# Altium schematic sheet Barometer.SchDoc
size A; SheetNumber: 4; SheetTotal: 4
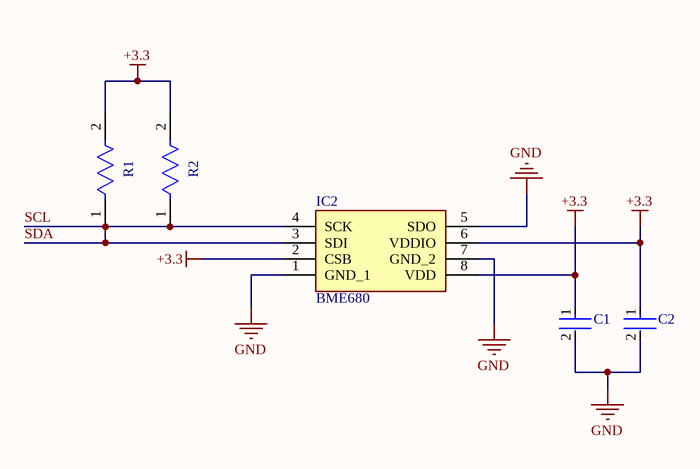
[diagram p0: Barometer.SchDoc]

## Parts
C1  CC0402KRX7R7BB104  [FP-CC0402-MFG]  (value not drawn)
C2  CC0402KRX7R7BB104  [FP-CC0402-MFG]  (value not drawn)
IC2  BME680  [BME680]
R1  AC1206JR-074K7L  [FP-AC1206-MFG]  (value not drawn)
R2  AC1206JR-074K7L  [FP-AC1206-MFG]  (value not drawn)

## Nets
+3.3: C1.1 C2.1 IC2.2(CSB) IC2.6(VDDIO) IC2.8(VDD) R1.2 R2.2
GND: C1.2 C2.2 IC2.1(GND_1) IC2.5(SDO) IC2.7(GND_2)
SCL: IC2.3(SDI) IC2.4(SCK) R1.1 R2.1  [also labelled SDA]

## Library data of the parts
C1 C2 = CMP-03422-000048-1: CAP CER 0.1UF 16V X7R 0402; Manufacturer: YAGEO; Material: Ceramic; Automotive Grade: NA; Capacitance: 100 nF; Temperature Coefficient: 30ppm/°C; Tolerance: 0.1; Value: 100 nF; Device Class L1: Passive Components; Temperature Range Low: -55°C; Device Class L3: Ceramic Capacitors; Temperature Characteristic: X7R; Ipc Land Pattern Name: CAPC10050X50; Temperature Range High: +125°C; Voltage Rating: 16 V; Temperature: -55°C to +125°C; RoHS: TRUE; Automotive: No; Height: 0.55mm; Device Class L2: Capacitors; Digikey Description: CAP CER 0.1UF 16V X7R 0402; Package: CC0402; Footprint Url: http://www.yageo.com/exep/pages/download/literatures/UPY-C_GEN_24.pdf; ComponentLink2Description: Datasheet; Category: Cap; Lead Free: Yes; Octopart: https://octopart.com/cc0402krx7r7bb104-yageo-42244624; ComponentLink2URL: http://www.yageo.com/documents/recent/UPY-GP_NP0_16V-to-50V_16.pdf; Manufacturer Part Number: CC0402KRX7R7BB104; Mouser Description: 0402 0.1 uF 16 V ±10 % Tolerance X7R SMT Multilayer Ceramic Capacitor
IC2 = BME680: Integrated Circuit; Manufacturer_Name: BOSCH; Datasheet Link: https://www.bosch-sensortec.com/media/boschsensortec/downloads/datasheets/bst-bme680-ds001.pdf; Height: 1mm; Manufacturer_Part_Number: BME680; Mouser Part Number: 262-BME680; Mouser Price/Stock: https://www.mouser.co.uk/ProductDetail/Bosch-Sensortec/BME680?qs=v271MhAjFHjo0yA%2FC4OnDQ%3D%3D; Arrow Part Number: BME680; Arrow Price/Stock: https://www.arrow.com/en/products/bme680/bosch?region=europe
R1 R2 = CMP-03412-025897-1: RES SMD 4.7K OHM 5% 1/4W 1206; Manufacturer: Yageo; Voltage Rating: 200V; Resistance: 4.7KΩ; Tolerance: 0.05; Power Rating: 0.25W; Value: 4.7KΩ; Automotive Grade: Grade 0; Category: Res; Lead Free: Yes; RoHS: TRUE; Device Class L3: Chip SMD Resistors; ComponentLink2URL: http://www.yageo.com/NewPortal/yageodocoutput?fileName=/pdf/R-Chip/PYu-AC_51_RoHS_L_6.pdf; Mouser Description: Thick Film Resistors - SMD 1/4W 4.7K ohm 5% AEC-Q200; Temperature Range Low: -55°C; Device Class L2: Resistors; Ipc Land Pattern Name: RESC310160X55; ComponentLink2Description: Datasheet; Digikey Description: RES SMD 4.7K OHM 5% 1/4W 1206; Footprint Url: http://www.yageo.com/exep/pages/download/literatures/PYu-R_Mount_10.pdf; Manufacturer Part Number: AC1206JR-074K7L; Octopart: https://octopart.com/ac1206jr-074k7l-yageo-30511310; Device Class L1: Passive Components; Series: AC; Package: AC1206; Temperature Range High: +155°C; Composition: Thick Film; Temperature: -55°C to +155°C; Height: 0.65mm; Automotive: Yes